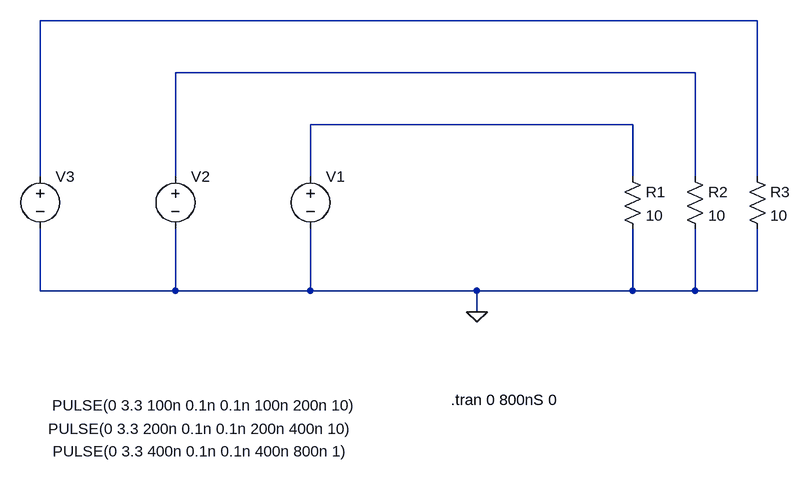
[diagram p0: schematic 3 input stimulus.asc]
3 input stimulus.asc, the LTspice schematic file:
Version 4
SHEET 1 880 680
WIRE 608 -96 -496 -96
WIRE 512 -16 -288 -16
WIRE 416 64 -80 64
WIRE -496 144 -496 -96
WIRE -288 144 -288 -16
WIRE -80 144 -80 64
WIRE 416 144 416 64
WIRE 512 144 512 -16
WIRE 608 144 608 -96
WIRE -496 320 -496 224
WIRE -288 320 -288 224
WIRE -288 320 -496 320
WIRE -80 320 -80 224
WIRE -80 320 -288 320
WIRE 176 320 -80 320
WIRE 416 320 416 224
WIRE 416 320 176 320
WIRE 512 320 512 224
WIRE 512 320 416 320
WIRE 608 320 608 224
WIRE 608 320 512 320
WIRE 176 352 176 320
FLAG 176 352 0
SYMBOL res 400 128 R0
SYMATTR InstName R1
SYMATTR Value 10
SYMBOL voltage -80 128 R0
WINDOW 3 -398 368 Left 2
SYMATTR InstName V1
SYMATTR Value PULSE(0 3.3 100n 0.1n 0.1n 100n 200n 10)
SYMBOL voltage -288 128 R0
WINDOW 3 -196 404 Left 2
SYMATTR InstName V2
SYMATTR Value PULSE(0 3.3 200n 0.1n 0.1n 200n 400n 10)
SYMBOL res 496 128 R0
SYMATTR InstName R2
SYMATTR Value 10
SYMBOL res 592 128 R0
SYMATTR InstName R3
SYMATTR Value 10
SYMBOL voltage -496 128 R0
WINDOW 3 19 439 Left 2
SYMATTR InstName V3
SYMATTR Value PULSE(0 3.3 400n 0.1n 0.1n 400n 800n 1)
TEXT 136 488 Left 2 !.tran 0 800nS 0

The netlist it stands for:
* 3 input stimulus.asc
R1 N003 0 10
V1 N003 0 PULSE(0 3.3 100n 0.1n 0.1n 100n 200n 10)
V2 N002 0 PULSE(0 3.3 200n 0.1n 0.1n 200n 400n 10)
R2 N002 0 10
R3 N001 0 10
V3 N001 0 PULSE(0 3.3 400n 0.1n 0.1n 400n 800n 1)
.tran 0 800nS 0
.backanno
.end